# EAGLE design AudioAmp_TLC272 (EAGLE 6.4)
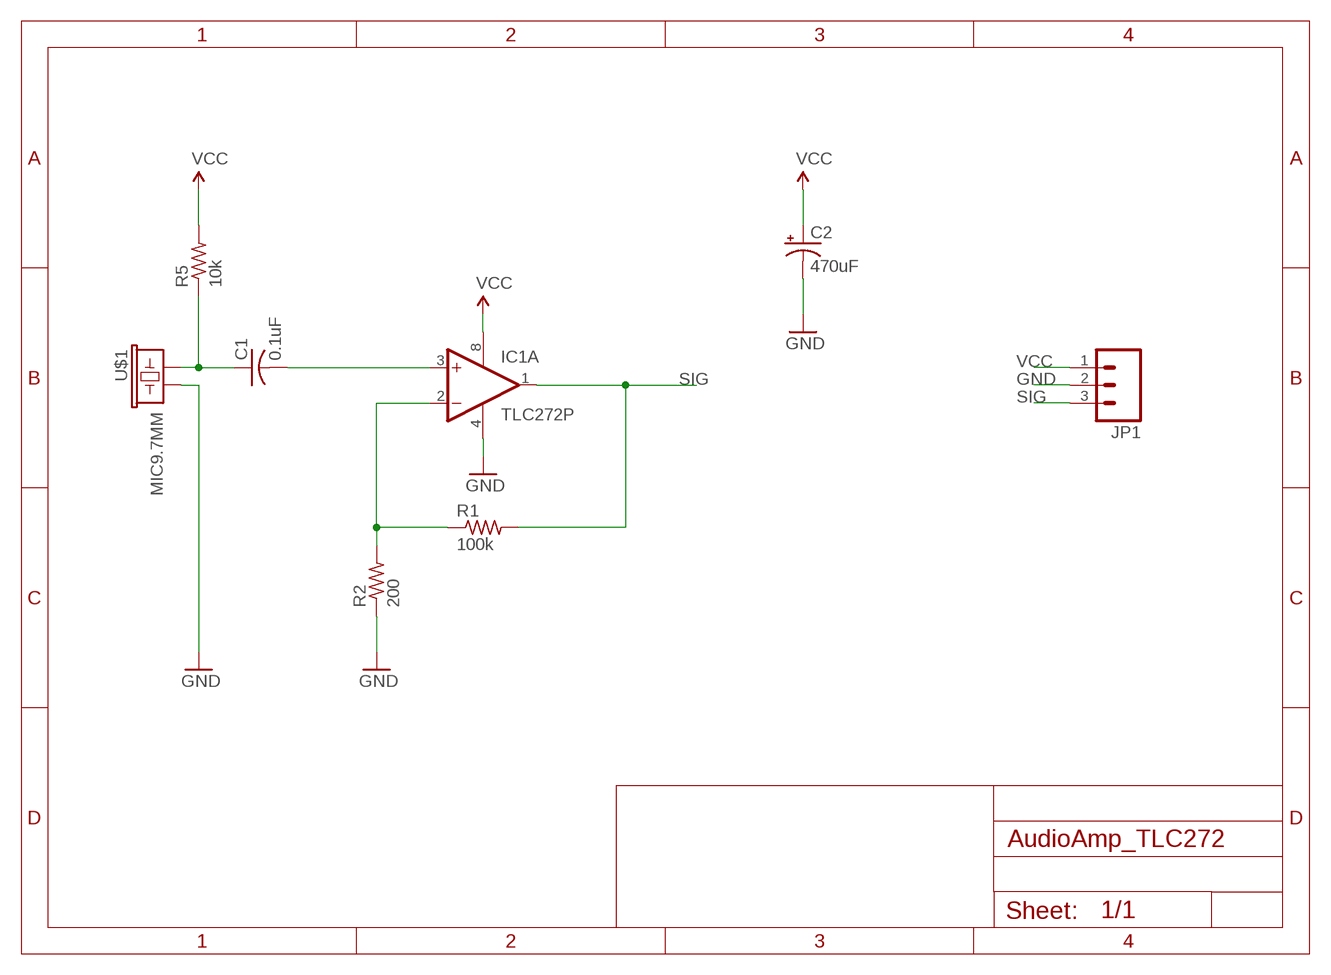
[diagram p0: schematic, sheet 1]

## Parts
C1  0.1uF  C-US025-025X050  [C025-025X050]
C2  470uF  CPOL-USE2.5-7  [E2,5-7]
IC1  TLC272P  [DIL08]
JP1  M03PTH  [1X03]
R1  100k  R-US_0207/10  [0207/10]
R2  200  R-US_0207/10  [0207/10]
R5  10k  R-US_0207/10  [0207/10]
U$1  MIC9.7MM  [MIC-9.7MM]

## Nets
GND: C2.- IC1.4(P:V-) JP1.2 R2.1 U$1.2
N$1: C1.1 R5.1 U$1.1
N$2: C1.2 IC1.3(A:+IN)
N$4: IC1.2(A:-IN) R1.1 R2.2
SIG: IC1.1(A:OUT) JP1.3 R1.2
VCC: C2.+ IC1.8(P:V+) JP1.1 R5.2
Unconnected: IC1.5(B:+IN) IC1.6(B:-IN) IC1.7(B:OUT)

## Library data of the parts
C1 = resistor:C-US: CAPACITOR, American symbol
C2 = resistor:CPOL-US: POLARIZED CAPACITOR, American symbol
IC1 = linear:TLC272: OP AMP
JP1 = SparkFun-Connectors:M03: Header 3 Standard 3-pin 0.1" header. Use with straight break away headers (SKU : PRT-00116), right angle break away headers (PRT-00553), swiss pins (PRT-00743), machine pins (PRT-00117), and female headers (PRT-00115). Molex polarized connector foot print use with SKU : PRT-08232 with associated crimp pins and housings.
R1 R2 R5 = resistor:R-US_: RESISTOR, American symbol
U$1 = SparkFun-Sensors:MIC: Omni-directional electret microphone. 9.7mm standard diameter.

## Board
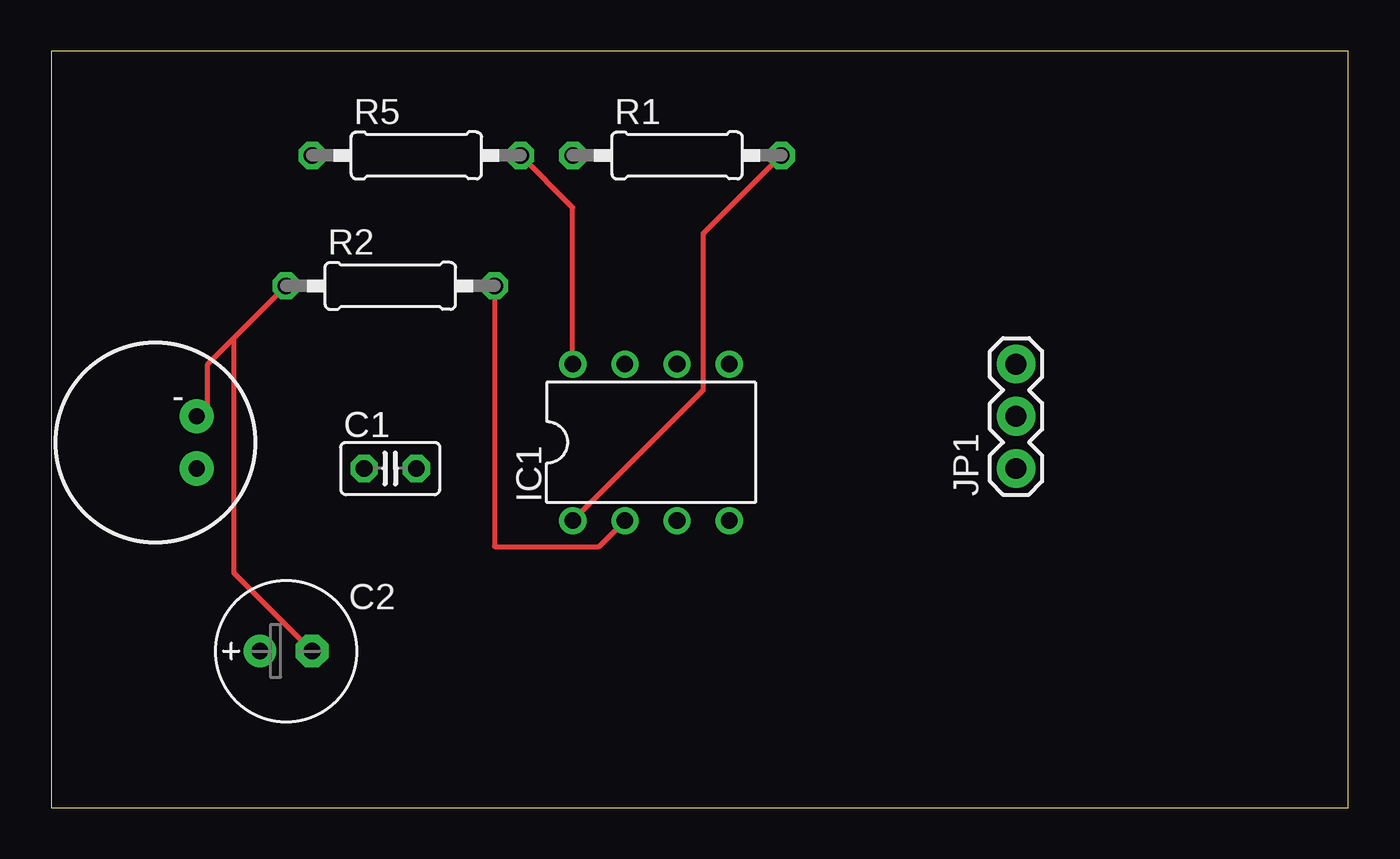
[diagram p1: board, top side]
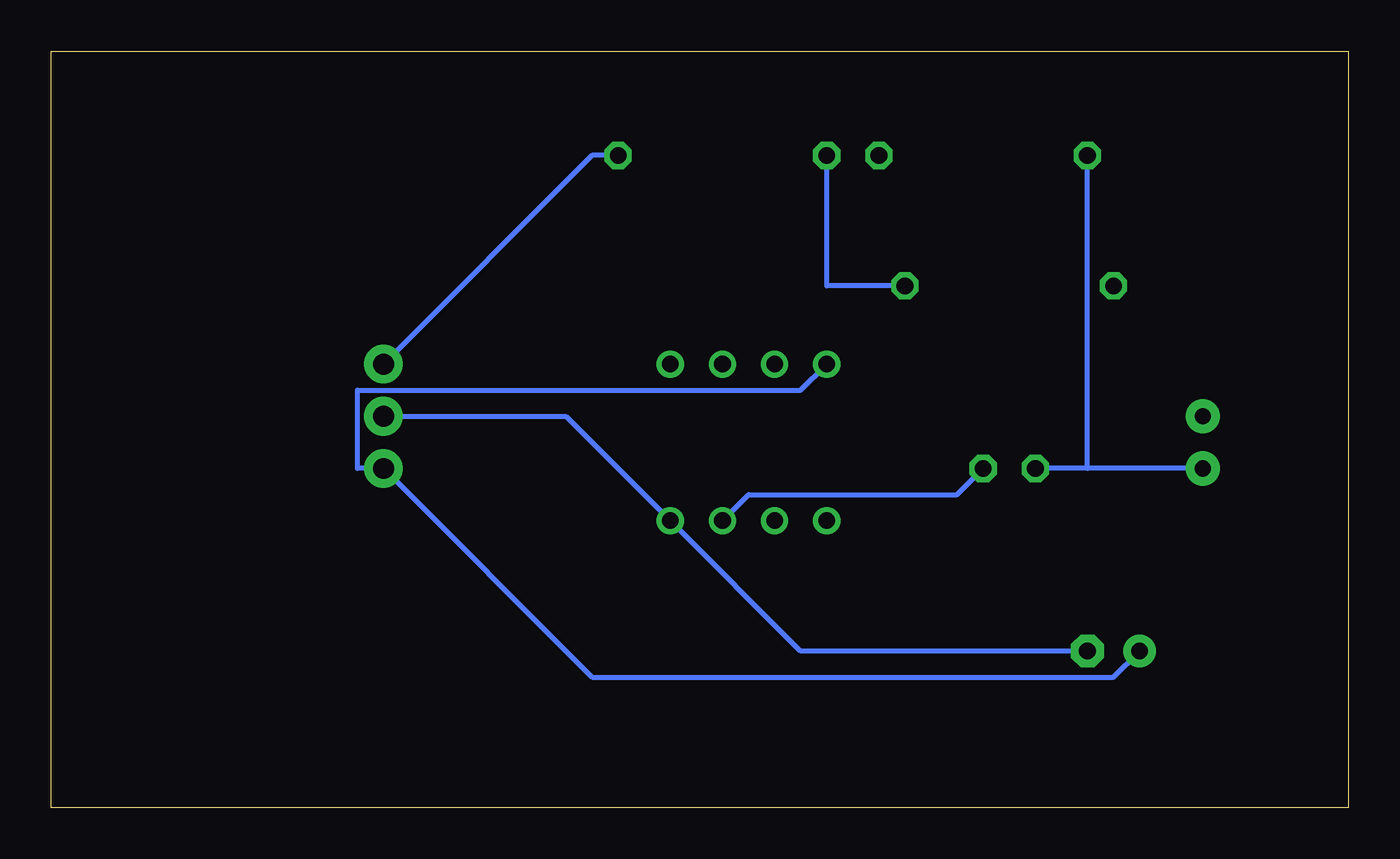
[diagram p2: board, bottom side, seen from below]

Size 63.17 x 36.82 mm. Coordinates in mm from the lower left corner, seen from the top.
Outline: 0,0 63.17,0 63.17,36.82 0,36.82 0,0
Copper layers (1*16): Top 0.035mm / dielectric 1.5mm / Bottom 0.035mm
Design rules "default": minimum track width 10mil, minimum drill 24mil, track to track 8mil, track to pad 8mil, pad to pad 8mil, via to via 8mil, smd to smd 8mil, copper to edge 40mil, drill to drill 8mil, minimum pad ring 10mil, minimum via ring 8mil, stop-mask expansion 4mil, vias tented up to drill 0mil, thermal gap 10mil

### Footprints (pad centres in the part's own frame; a part is rotated, then mirrored left to right if it is on the bottom)
C025-025X050 = drill 0.813 octagon: 1 -1.27,0; 2 1.27,0
E2,5-7 = drill 0.813 pad 1.6: + -1.27,0 | drill 0.813 pad 1.6 octagon: - 1.27,0
DIL08 = drill 0.813 pad 1.27: 1 -3.81,-3.81; 2 -1.27,-3.81; 3 1.27,-3.81; 4 3.81,-3.81; 5 3.81,3.81; 6 1.27,3.81; 7 -1.27,3.81; 8 -3.81,3.81
1X03 = drill 1.016 pad 1.88: 1 0,0; 2 2.54,0; 3 5.08,0
0207/10 = drill 0.813 octagon: 1 -5.08,0; 2 5.08,0
MIC-9.7MM = drill 0.8 pad 1.676: 1 -2,1.27; 2 -2,-1.27

### Placement (x,y rotation side)
C1  16.51,16.51 0 top
C2  11.43,7.62 0 top
IC1  29.21,17.78 0 top
JP1  46.99,16.51 90 top
R1  30.48,31.75 0 top
R2  16.51,25.4 0 top
R5  17.78,31.75 0 top
U$1  5.08,17.78 180 top

### Tracks (layer width: path | path; a pad name or v marks a point on that pad's centre or on a via)
GND
  Top 0.254: 8.89,22.86 7.62,21.59 7.62,19.05 U$1.2 | 8.89,22.86 R2.1 | C2.- 8.89,11.43 8.89,22.86
  Bottom 0.254: JP1.2 38.1,19.05 IC1.4 26.67,7.62 C2.-
N$1
  Bottom 0.254: U$1.1 12.7,16.51 | 12.7,16.51 C1.1 | 12.7,16.51 R5.1
N$2
  Bottom 0.254: C1.2 19.05,15.24 29.21,15.24 IC1.3
N$4
  Top 0.254: IC1.2 26.67,12.7 21.59,12.7 R2.2
  Bottom 0.254: R1.1 25.4,25.4 R2.2
SIG
  Top 0.254: IC1.1 31.75,20.32 31.75,27.94 R1.2
  Bottom 0.254: JP1.3 36.83,31.75 R1.2
VCC
  Top 0.254: R5.2 25.4,29.21 IC1.8
  Bottom 0.254: C2.+ 11.43,6.35 36.83,6.35 JP1.1 48.26,16.51 48.26,20.32 26.67,20.32 IC1.8